# EasyEDA Pro project RinaBoard.eprj, board MasterControlPCB
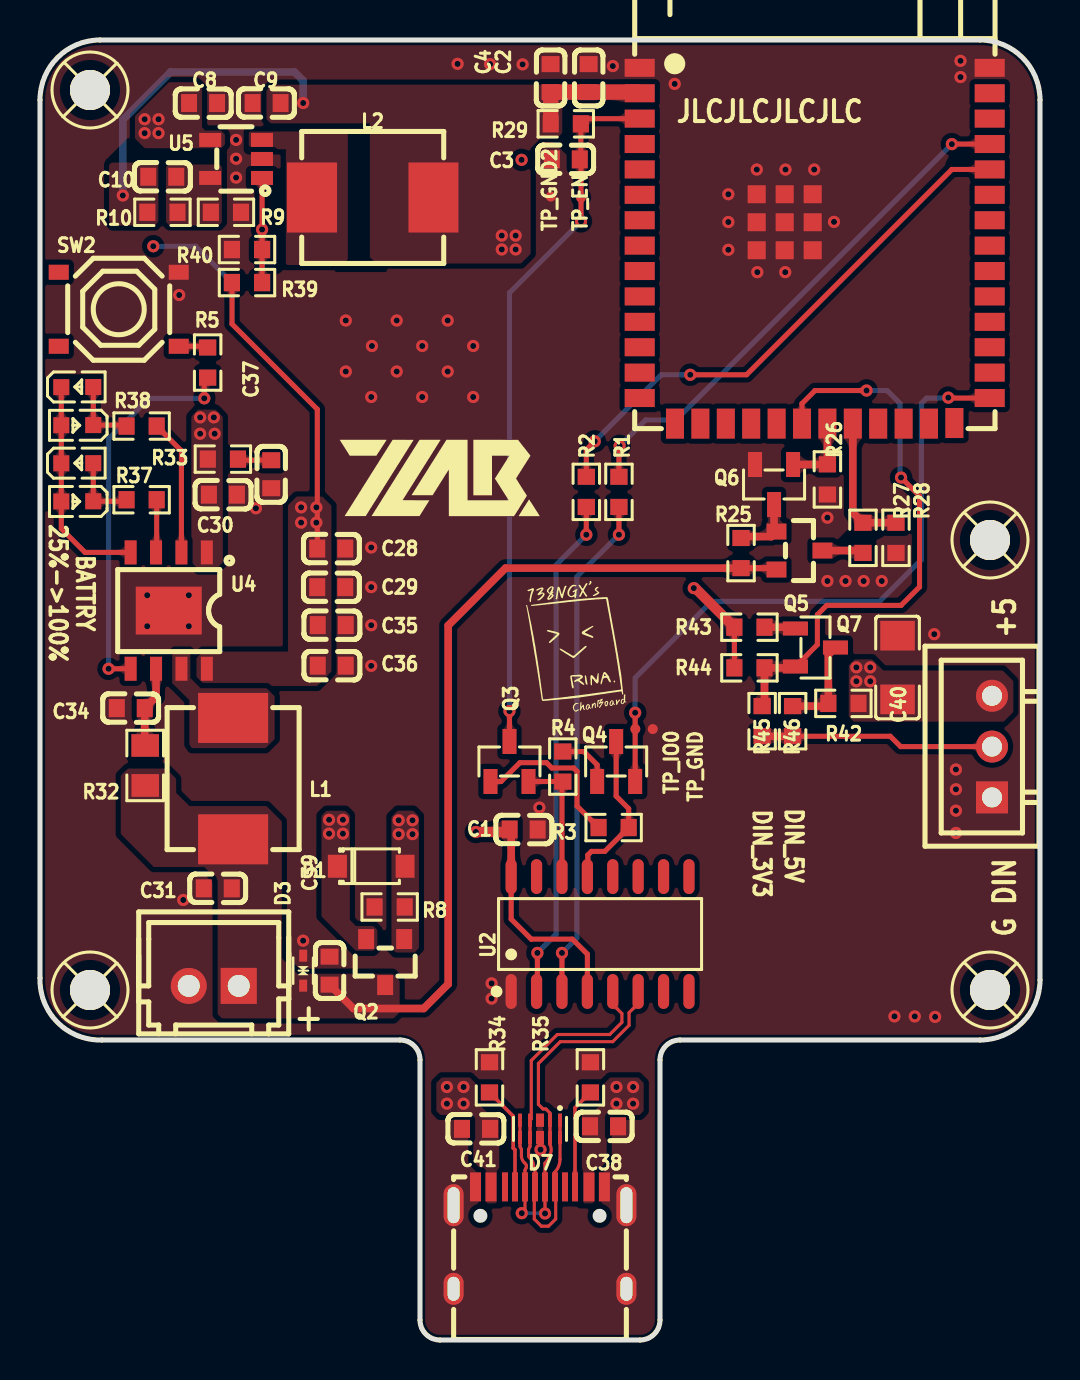
[diagram p7: board, top side]
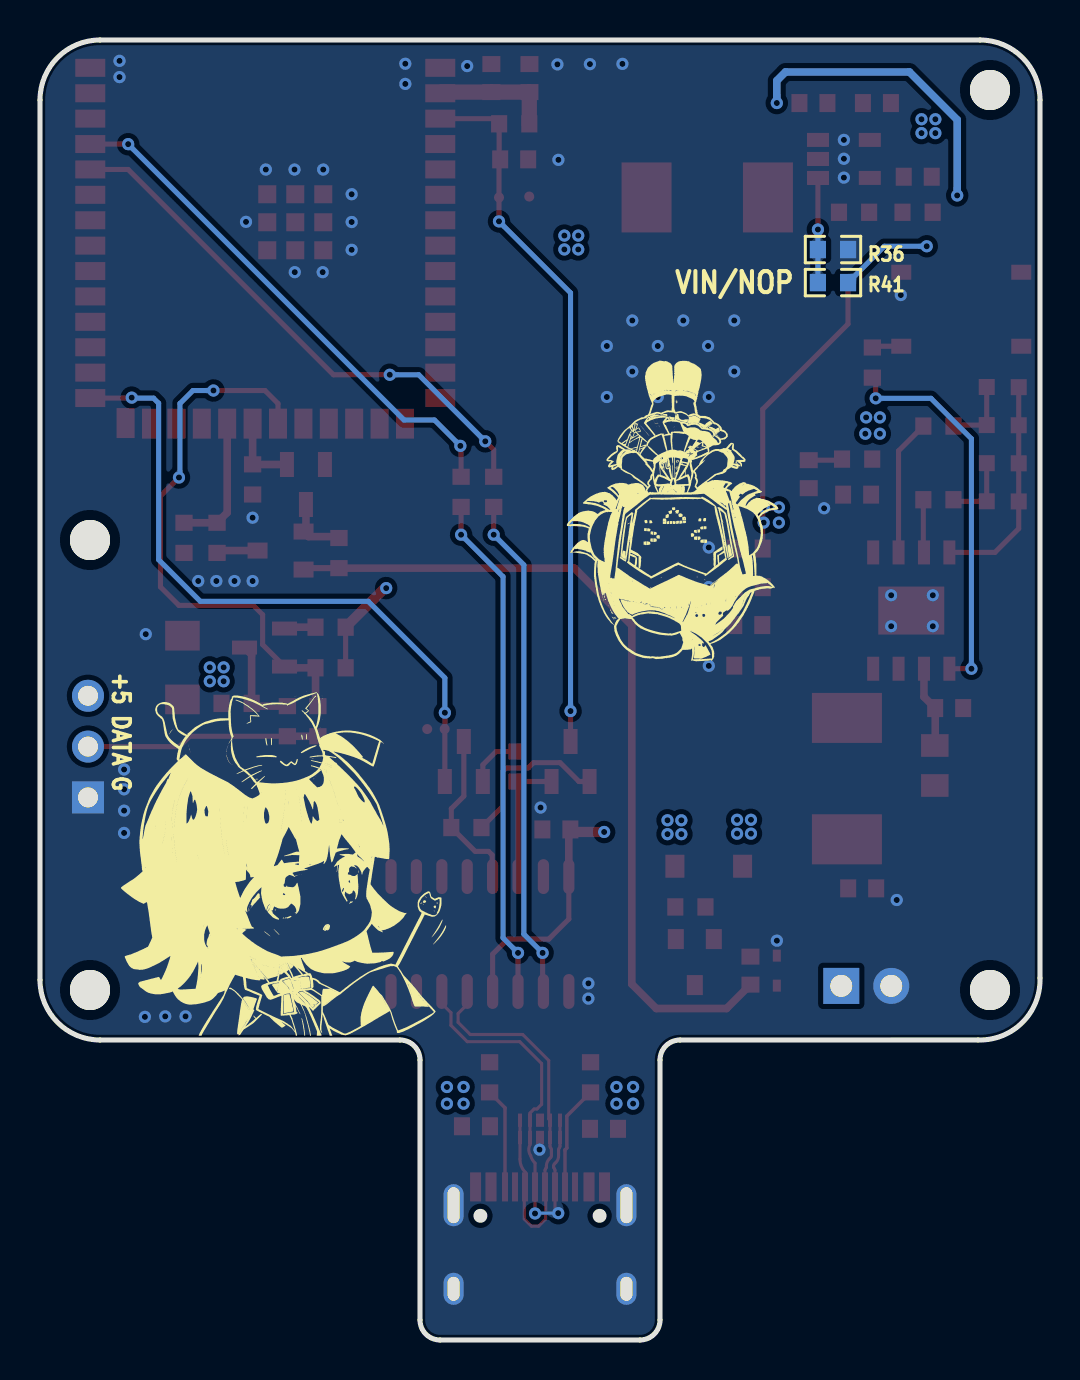
[diagram p8: board, bottom side, seen from below]

Outline 50 x 65 mm; copper layers: Top Layer, GND, PWR, Bottom Layer. Coordinates in mm from the lower left corner of the outline.
Outline path: 0,62 0,18.1 arc(0.88,15.88) 3.1,15 18,15 arc(18.71,14.71) 19,14 19,1 arc(19.29,0.29) 20,0 30,0 arc(30.71,0.29) 31,1 31,14 arc(31.29,14.71) 32,15 47,15 arc(49.12,15.88) 50,18 50,62 arc(49.12,64.12) 47,65 3,65 arc(0.88,64.12) 0,62
Stack: Top Layer 0.035mm 外层铜厚1oz / Dielectric1 0.2104mm 7628 RC49% 8.6mil / GND 0.0152mm 内层铜厚 / Dielectric2 1.065mm 1.1mm H/HOZ Copper / PWR 0.0152mm 内层铜厚 / Dielectric3 0.2104mm 7628 RC49% 8.6mil / Bottom Layer 0.035mm 外层铜厚1oz

## Design rules (mm)
net USB_P: USB
net USB_N: USB
template: 自定义配置
spacing copperThickness1oz (default): track to track 0.102, other pairs 0.152 to 0.3
spacing copperThickness2oz: track to track 0.203, other pairs 0.152 to 0.3
track width copperThickness1oz (default): min 0.127, default 0.254, max 2.54
track width copperThickness2oz: min 0.203, default 0.254, max 2.54
differential pair differentialPair (default): width min 0.127, default 0.155, max 2.54; gap min 0.152, default 0.203
via viaSize (default): diameter min 0.5, default 0.61, max 10; hole min 0.3, default 0.305, max 6.299

## Placement (name value [footprint] x y rotation side)
C1  0.1uF  [C0603]  24.18 25.53 180 top
C2  0.1uF  [C0603]  27.43 63.09 270 top
C3  1uF  [C0603]  26.29 59.03 0 top
C4  22uF  [C0603]  25.53 63.09 270 top
C8  10uF  [C0603]  8.15 61.85 180 top
C9  10uF/10V  [C0603]  11.33 61.85 0 top
C10  22pF  [C0603]  6.11 58.16 180 top
C28  22uF  [C0603]  14.56 39.57 180 top
C29  22uF  [C0603]  14.56 37.64 180 top
C30  10uF  [C0603]  9.14 42.27 180 top
C31  22uF/25V  [C0603]  8.89 22.58 0 top
C34  22uF  [C0603]  4.54 31.59 0 top
C35  22uF  [C0603]  14.59 35.74 180 top
C36  22uF  [C0603]  14.59 33.72 180 top
C37  10uF  [C0603]  11.56 43.29 90 top
C38  10uF  [C0603]  28.2 10.68 180 top
C39  10uF  [C0603]  14.48 18.47 270 top
C40  47uF  [C1206]  42.88 33.62 270 top
C41  10uF  [C0603]  21.8 10.56 0 top
CN1  BATTERY  [CONN-TH_2P-P2.50_HX25003-2A]  8.69 17.7 180 top
CN2  LED  [CONN-TH_3P-P2.54_2501S-3P]  47.6 29.67 90 top
D1  DSK34  [SOD-123_L2.8-W1.8-LS3.7-RD]  16.56 23.69 0 top
D3  ESD5B5.0ST1G-N  [SOD-523_L1.2-W0.8-LS1.6-BI]  13.16 18.47 90 top
D7  PUSB3F96X  [DFN2510-10_L2.5-W1.0-P0.50-BL]  25 10.56 180 top
L1  1uH  [IND-SMD_L7.1-W6.6_MJC-0603T]  9.66 28.07 270 top
L2  1uH  [IND-SMD_L7.1-W6.6_MJC-0603T]  16.64 57.13 0 top
LED1  FC-DA1608BK-470H10  [LED0603-RD_WHITE]  1.86 47.65 0 top
LED2  FC-DA1608BK-470H10  [LED0603-RD_WHITE]  1.86 45.74 180 top
LED3  FC-DA1608BK-470H10  [LED0603-RD_WHITE]  1.86 43.84 0 top
LED4  FC-DA1608BK-470H10  [LED0603-RD_WHITE]  1.86 41.93 180 top
Q2  AO3401A_C347476  [AO3401A_SOT-23-3]  17.26 18.9 90 top
Q3  S9013-E  [SOT-23-3_L2.9-W1.3-P1.90-LS2.4-BR]  23.47 28.92 270 top
Q4  S9013-E  [SOT-23-3_L2.9-W1.3-P1.90-LS2.4-BR]  28.81 28.92 270 top
Q5  AO3401A_C347476  [AO3401A_SOT-23-3]  37.97 39.47 180 top
Q6  AO3400A_C347475  [AO3400A_SOT-23-3]  36.7 42.78 90 top
Q7  AO3400A_C347475  [AO3400A_SOT-23-3]  38.77 34.62 180 top
R1  0R  [R0603]  28.95 42.41 270 top
R2  0R  [R0603]  27.32 42.41 90 top
R3  10k  [R0603]  28.68 25.62 180 top
R4  10k  [R0603]  26.14 28.67 90 top
R5  10K  [R0603]  8.38 48.87 270 top
R8  10K  [R0603]  17.48 21.65 0 top
R9  22K  [R0603]  9.3 56.39 180 top
R10  100K  [R0603]  6.12 56.39 180 top
R25  10K  [R0603]  35.05 39.35 270 top
R26  10K  [R0603]  39.37 43.03 90 top
R27  4.7K  [R0603]  41.15 40.11 270 top
R28  1K  [R0603]  42.8 40.11 90 top
R29  10k  [R0603]  26.29 60.81 0 top
R32  0.5R  [R0805]  5.26 28.73 270 top
R33  2R  [R0603]  9.14 44.05 0 top
R34  5.1k  [R0603]  22.47 13.13 270 top
R35  5.1k  [R0603]  27.52 13.13 270 top
R36  1M  [R0603]  10.35 54.52 180 bottom
R37  10k/nop  [R0603]  5.08 42.01 0 top
R38  10k/nop  [R0603]  5.08 45.7 0 top
R39  11k  [R0603]  10.35 52.87 0 top
R40  18k  [R0603]  10.35 54.52 180 top
R41  nop  [R0603]  10.35 52.87 0 bottom
R42  10k  [R0603]  40.17 31.83 180 top
R43  1k  [R0603]  35.47 35.64 0 top
R44  10k  [R0603]  35.47 33.61 0 top
R45  0R  [R0603]  36.11 30.94 270 top
R46  0R  [R0603]  37.63 30.94 270 top
SCREW1  -  [M2螺丝]  2.5 17.5 0 top
SCREW2  -  [M2螺丝]  2.5 62.5 0 top
SCREW3  -  [M2螺丝]  47.5 17.5 0 top
SCREW4  -  [M2螺丝]  47.5 40 0 top
SW2  TS-1187A-B-A-B  [SW-SMD_4P-L5.1-W5.1-P3.70-LS6.5-TL_H1.5]  3.94 51.54 180 top
TP_EN  -  [Test-Point-0.5mm]  27.05 57.13 180 top
TP_GND  -  [Test-Point-0.5mm]  30.64 30.55 270 top
TP_GND2  -  [Test-Point-0.5mm]  25.54 57.17 180 top
TP_IO0  -  [Test-Point-0.5mm]  29.77 30.55 270 top
U1  ESP32-S3-WROOM-1-N16R8  [WIRELM-SMD_ESP32-S3-WROOM-1]  38.74 54.71 0 top
U2  CH340C  [SOP-16_L10.0-W3.9-P1.27-LS6.0-BL]  28 20.3 0 top
U4  IP5307  [ESOP-8_L4.9-W3.9-P1.27-LS6.0-BL-EP]  6.44 36.47 180 top
U5  SY8089A1AAC  [TSOT-23-5_L2.9-W1.6-P0.95-LS2.8-BR]  9.81 59.05 0 top
USB1  TYPEC-304-BCP16  [USB-C-SMD_TYPEC-304-BCP16]  25 5.11 0 top

## Footprints (pads in the part's own frame, mm; a bottom-side part is the same pattern mirrored in y, then rotated)
AO3400A_SOT-23-3
  rect 1.25x0.7 smd: 1(1,-0.95) 2(1,0.95) 3(-1,0)
AO3401A_SOT-23-3
  rect 1x0.8 smd: 1(1.15,-0.95) 2(1.15,0.95) 3(-1.15,0)
C0603
  rect 0.8x0.9 smd: 1(-0.7,0) 2(0.7,0)
C1206
  rect 1.485x1.728 smd: 1(-1.593,0) 2(1.593,0)
CONN-TH_2P-P2.50_HX25003-2A
  rect 1.8x1.8 hole 1.1: 1(-1.25,0)
  round 1.8 hole 1.1: 2(1.25,0)
CONN-TH_3P-P2.54_2501S-3P
  rect 1.6x1.6 hole 1: 1(-2.54,0)
  round 1.6 hole 1: 2(0,0) 3(2.54,0)
DFN2510-10_L2.5-W1.0-P0.50-BL
  rect 0.2x0.665 smd: 1(-1,-0.433) 2(-0.5,-0.433) 4(0.5,-0.433) 5(1,-0.433) 6(1,0.433) 7(0.5,0.433) 9(-0.5,0.433) 10(-1,0.433)
  rect 0.4x0.665 smd: 3(0,-0.433) 8(0,0.433)
ESOP-8_L4.9-W3.9-P1.27-LS6.0-BL-EP
  rect 0.6x1.2 smd: 1(-1.905,-2.909) 2(-0.635,-2.909) 3(0.635,-2.909) 4(1.905,-2.909) 5(1.905,2.909) 6(0.635,2.909) 7(-0.635,2.909) 8(-1.905,2.909)
  rect 3.3x2.4 smd: 9(0,0)
IND-SMD_L7.1-W6.6_MJC-0603T
  rect 2.5x3.5 smd: 1(-3.035,0) 2(3.035,0)
LED0603-RD_WHITE
  rect 0.8x0.8 smd: 1(-0.799,-0.004) 2(0.799,0.004)
M2螺丝
  round 2 hole 2: 1(0,0)
R0603
  rect 0.806x0.864 smd: 1(-0.753,0) 2(0.753,0)
R0805
  rect 1.133x1.377 smd: 1(-1,0) 2(1,0)
SOD-123_L2.8-W1.8-LS3.7-RD
  rect 0.95x1.15 smd: 1(-1.692,0) 2(1.692,0)
SOD-523_L1.2-W0.8-LS1.6-BI
  rect 0.6x0.4 smd: 1(-0.75,0) 2(0.75,0)
SOP-16_L10.0-W3.9-P1.27-LS6.0-BL
  oval 0.56x1.745 smd: 1(-4.445,-2.873) 2(-3.175,-2.873) 3(-1.905,-2.873) 4(-0.635,-2.873) 5(0.635,-2.873) 6(1.905,-2.873) 7(3.175,-2.873) 8(4.445,-2.873) 9(4.445,2.873) 10(3.175,2.873) 11(1.905,2.873) 12(0.635,2.873) 13(-0.635,2.873) 14(-1.905,2.873) 15(-3.175,2.873) 16(-4.445,2.873)
SOT-23-3_L2.9-W1.3-P1.90-LS2.4-BR
  rect 1.25x0.7 smd: 1(1,-0.95) 2(1,0.95) 3(-1,0)
SW-SMD_4P-L5.1-W5.1-P3.70-LS6.5-TL_H1.5
  rect 1x0.75 smd: 1(-3,1.85) 2(3,1.85) 3(-3,-1.85) 4(3,-1.85)
Test-Point-0.5mm
  round 0.5 smd: 1(0,0)
TSOT-23-5_L2.9-W1.6-P0.95-LS2.8-BR
  rect 1.1x0.7 smd: 1(1.294,-0.951) 2(1.294,-0.001) 3(1.294,0.951) 4(-1.294,0.951) 5(-1.294,-0.949)
USB-C-SMD_TYPEC-304-BCP16
  oval 1x2.1 hole 0.6x1.8: 13(-4.32,1.633) 14(4.32,1.633)
  oval 1x1.6 hole 0.6x1.2: 15(-4.32,-2.547) 16(4.32,-2.547)
  rect 0.55x1.45 smd: A1B12(-3.225,2.547) A4B9(-2.45,2.547) B1A12(3.22,2.547) B4A9(2.45,2.547)
  rect 0.3x1.45 smd: A5(-1.25,2.547) A6(-0.25,2.547) A7(0.25,2.547) A8(1.25,2.547) B5(1.75,2.547) B6(0.75,2.547) B7(-0.75,2.547) B8(-1.75,2.547)
WIRELM-SMD_ESP32-S3-WROOM-1
  rect 1.5x0.9 smd: 1(-8.75,8.895) 2(-8.75,7.625) 3(-8.75,6.355) 4(-8.75,5.085) 5(-8.75,3.815) 6(-8.75,2.545) 7(-8.75,1.275) 8(-8.75,0.005) 9(-8.75,-1.265) 10(-8.75,-2.535) 11(-8.75,-3.805) 12(-8.75,-5.075) 13(-8.75,-6.345) 14(-8.75,-7.615) 27(8.75,-7.615) 28(8.75,-6.345) 29(8.75,-5.075) 30(8.75,-3.805) 31(8.75,-2.535) 32(8.75,-1.265) 33(8.75,0.005) 34(8.75,1.275) 35(8.75,2.545) 36(8.75,3.815) 37(8.75,5.085) 38(8.75,6.355) 39(8.75,7.625) 40(8.75,8.895)
  rect 0.9x1.5 smd: 15(-6.985,-8.895) 16(-5.715,-8.895) 17(-4.445,-8.895) 18(-3.175,-8.895) 19(-1.905,-8.895) 20(-0.635,-8.895) 21(0.635,-8.895) 22(1.905,-8.895) 23(3.175,-8.895) 24(4.445,-8.895) 25(5.715,-8.895) 26(6.985,-8.865)
  rect 0.9x0.9 smd: 41(-2.9,2.575) 41(-2.9,1.175) 41(-2.9,-0.225) 41(-1.5,2.575) 41(-1.5,1.175) 41(-1.5,-0.225) 41(-0.1,2.575) 41(-0.1,1.175) 41(-0.1,-0.225)

## Nets
+3V3: C1.2 C2.2 C4.2 C9.2 C10.2 L2.2 R10.2 R29.1 R43.1 R44.1 U1.2 U2.4 U2.16
+5V: C28.2 C29.2 C35.2 C36.2 C40.2 CN2.3 R39.1 R42.1 U4.8
GND: C1.1 C2.1 C3.1 C4.1 C8.1 C9.1 C28.1 C29.1 C30.1 C31.1 C34.1 C35.1 C36.1 C37.1 C38.1 C39.1 C40.1 C41.1 CN1.2 CN2.1 D3.2 D7.3 D7.8 Q6.2 R8.1 R9.1 R26.1 R28.1 R34.1 R35.1 R36.2 R40.2 SW2.3 TP_GND.1 TP_GND2.1 U1.1 U1.40 U1.41 U2.1 U4.9 U5.2 USB1.13 USB1.14 USB1.15 USB1.16 USB1.A1B12 USB1.B1A12
VBAT: C31.2 C39.2 CN1.1 D3.1 L1.2 Q2.3 Q5.2 R25.2 R32.2
VBUS: C30.2 C38.2 C41.2 D1.2 Q2.1 R8.2 R33.1 U4.1 USB1.A4B9 USB1.B4A9
VIN: C8.2 D1.1 Q2.2 R41.1 U5.4
ADC_BAT: R27.1 R28.2 U1.22
ADC_CON: Q6.1 R26.2 U1.21
CC1: R34.2 USB1.A5
CC2: R35.2 USB1.B5
CH_RXD: R1.2 U2.3
CH_TXD: R2.1 U2.2
DC_EN: R36.1 R39.2 R40.1 R41.2 U5.1
DTR: Q4.3 R3.1 U2.13
EN: C3.2 Q3.3 R29.2 TP_EN.1 U1.3
IO0: Q4.2 TP_IO0.1 U1.27
IP5307_KEY: R5.1 SW2.1
LED_DATA_3V3: Q7.2 R44.2 R45.1 U1.20
LED_DATA_5V: Q7.3 R42.2 R46.1
LED_DATA_OUT: CN2.2 R45.2 R46.2
MCU_RXD: R2.2 U1.36
MCU_TXD: R1.1 U1.37
RTS: Q3.2 R4.1 U2.14
USB_N: D7.2 D7.5 D7.6 D7.9 U2.6 USB1.A7 USB1.B7
USB_P: D7.1 D7.4 D7.7 D7.10 U2.5 USB1.A6 USB1.B6
$1N2176: Q3.1 R3.2
$1N2324: Q4.1 R4.2
$2N521: L1.1 U4.7
$2N524: R5.2 U4.5
$2N1221: C34.2 R32.1 U4.6
$2N1458: LED1.1 LED2.2 LED3.1 LED4.2 U4.4
$2N2157: C37.2 R33.2
$2N3725: L2.1 U5.3
$2N3729: C10.1 R9.2 R10.1 U5.5
$2N5657: R37.2 U4.3
$2N5662: LED3.2 LED4.1 R37.1
$2N5690: R38.2 U4.2
$2N5696: LED1.2 LED2.1 R38.1
$3N4901: Q7.1 R43.2
$4N342: Q5.3 R27.2
$4N345: Q5.1 Q6.3 R25.1

Pads without a net: SCREW1 1; SCREW2 1; SCREW3 1; SCREW4 1; SW2 2 4; U1 4 5 6 7 8 9 10 11 12 13 14 15 16 17 18 19 23 24 25 26 28 29 30 31 32 33 34 35 38 39; U2 7 8 9 10 11 12 15; USB1 A8 B8

## Via types
v1: diameter 0.61, hole 0.305, Top Layer to Bottom Layer, 122 vias

## Routing (per net, layer and track width the routed paths; a pad name or vN(x,y) marks a point on that pad's centre or on a via; arc(x,y) is an arc through that point)
+3V3: length 113.1
  Top Layer w0.254: U2.16 23.56,21.05 24.56,20.04 26.62,20.04 27.37,19.29 U2.4 ; R44.1 R43.1
  Top Layer w0.381: U2.16 23.56,25.45 C1.2
  Top Layer w0.508: R43.1 32.76,37.59 v1(32.69,37.59) ; C1.2 23.36,25.4 v1(21.79,25.4)
  Top Layer w0.762: R29.1 25.54,62.39 C4.2 C2.2 29.93,62.39 U1.2
  PWR w0.508: v1(21.79,25.4) 21.79,27.81 19.86,29.75 13.03,29.75 11.51,31.27 11.51,42.83 12.85,44.17 21.87,44.17 23.09,45.39 v1(23.09,54.53) v1(23.09,55.22) ; v1(32.69,37.59) 24.23,37.59 23.78,38.04 v1(23.78,54.53) v1(23.78,55.22)
  Bottom Layer w0.381: v1(13.16,61.85) 13.16,62.97 12.73,63.4 6.53,63.4 4.14,61.01 v1(4.14,57.23)
+5V: length 15.1
  Top Layer w0.254: C28.2 13.86,46.54 9.6,50.8 9.6,52.87 R39.1
  vias: v1(13.06,41.63) v1(13.06,40.87) v1(13.82,41.63) v1(13.82,40.87) v1(40.82,33.63) v1(40.82,32.94) v1(41.51,33.63) v1(41.51,32.94)
GND:
  vias: v1(5.36,37.24) v1(5.36,35.69) v1(6.96,52.25) v1(7.16,22) v1(7.44,37.24) v1(7.44,35.69) v1(9.81,60) v1(9.81,59.06) v1(9.81,58.12) v1(10.79,41.59) v1(13.16,19.97) v1(15.29,50.97) v1(15.29,48.42) v1(16.6,49.7) v1(16.56,47.15) v1(16.56,39.63) v1(16.56,37.64) v1(16.56,35.74) v1(16.56,33.71) v1(17.84,50.97) v1(17.84,48.42) v1(19.11,49.7) v1(19.11,47.15) v1(20.38,50.97) v1(20.38,48.42) v1(20.88,63.81) v1(21.66,49.7) v1(21.66,47.15) v1(22.5,63.79) v1(22.58,17.83) v1(22.58,17.07) v1(24.13,63.78) v1(24.08,59.01) v1(24.97,26.62) v1(25.03,9.52) v1(28.64,63.7) v1(31.74,63.81) v1(31.74,62.8) v1(34.42,57.29) v1(34.42,55.9) v1(34.42,54.51) v1(35.84,58.52) v1(35.87,53.39) v1(37.27,58.52) v1(37.26,53.39) v1(38.71,58.52) v1(39.37,41.11) v1(39.37,37.95) v1(39.7,55.91) v1(40.28,37.95) v1(41.18,37.95) v1(42.09,37.95) v1(42.72,16.18) v1(43.74,16.18) v1(44.71,35.29) v1(44.75,16.16) v1(45.8,28.53) v1(45.8,27.53) v1(45.8,26.47) v1(45.8,25.35) v1(46.03,63.96) v1(46.03,63.15)
VBAT: length 42.5
  Top Layer w0.305: Q5.2 36.75,38.59 R25.2
  Top Layer w0.381: R25.2 23.28,38.59 20.41,35.73 20.41,17.8 19.19,16.58 15.67,16.58 C39.2
VBUS:
  vias: v1(8.01,46.13) v1(8.01,45.31) v1(8.69,46.13) v1(8.73,45.31) v1(17.93,25.99) v1(17.93,25.29) v1(18.63,25.99) v1(18.63,25.29) v1(20.35,12.65) v1(20.35,11.82) v1(21.18,12.65) v1(21.18,11.82) v1(28.82,12.65) v1(28.82,11.82) v1(29.65,12.65) v1(29.65,11.82)
VIN: length 4.7
  Bottom Layer w0.254: v1(5.66,54.69) 7.78,54.69 R41.1
  vias: v1(5.23,61.04) v1(5.23,60.34) v1(5.93,61.04) v1(5.93,60.34) v1(14.45,26.01) v1(14.45,25.32) v1(15.15,26.01) v1(15.15,25.32)
ADC_BAT: length 6.8
  Top Layer w0.381: U1.22 40.64,41.37 R27.1 R28.2
ADC_CON: length 3.8
  Top Layer w0.381: U1.21 R26.2 39.36,43.78 Q6.1
CC1: length 5.3
  Top Layer w0.178: USB1.A5 23.75,9.51 23.66,9.6 23.66,11.19 22.47,12.38
CC2: length 5
  Top Layer w0.178: 27.52,12.38 26.75,11.61 26.75,7.66
CH_RXD: length 25.4
  Top Layer w0.254: 28.95,41.65 v1(28.95,40.26) ; U2.3 v1(26.1,19.35)
  Bottom Layer w0.254: v1(26.1,19.35) 26.85,20.1 26.85,38.17 v1(28.95,40.26)
CH_TXD: length 25.3
  Top Layer w0.254: v1(24.87,19.35) 24.87,17.47 U2.2 ; 27.32,41.65 v1(27.32,40.26)
  Bottom Layer w0.254: v1(24.87,19.35) 25.81,20.29 25.81,38.76 v1(27.32,40.26)
DC_EN: length 7.9
  Top Layer w0.254: U5.1 11.1,58.1 v1(11.1,55.53) R40.1 R39.2
  Bottom Layer w0.254: R39.2 R40.1 v1(11.1,55.53)
DTR: length 8.3
  Top Layer w0.254: U2.13 27.39,23.19 27.39,24.25 27.57,24.43 28.24,24.43 R3.1 29.43,26.57 28.81,27.19 Q4.3
EN: length 35.5
  Top Layer w0.254: v1(27.05,55.93) 27.05,57.13 27.05,58.97 C3.2 27.04,59.08 R29.2 27.3,61.07 U1.3 ; Q3.3 v1(23.47,31.45)
  Bottom Layer w0.254: v1(23.47,31.45) 23.47,52.36 v1(27.05,55.93)
IO0: length 33.3
  Top Layer w0.254: Q4.2 v1(29.76,31.36) ; v1(45.41,47.12) 45.44,47.1 U1.27
  Bottom Layer w0.254: v1(29.76,31.36) 29.76,33.1 33.59,36.93 41.99,36.93 44.07,39.02 44.07,46.84 44.32,47.09 45.39,47.09 v1(45.41,47.12)
IP5307_KEY: length 1.5
  Top Layer w0.254: SW2.1 8.32,49.69 R5.1
LED_DATA_3V3: length 28.3
  Top Layer w0.254: U1.20 38.1,46.82 38.75,47.47 v1(41.33,47.47) ; v1(43.05,43.12) 43.98,42.2 43.98,37.65 43.05,36.73 39.33,36.73 38.87,36.27 38.87,34.77 Q7.2
  Top Layer w0.381: Q7.2 37.71,33.61 R44.2 36.22,31.81 R45.1
  Bottom Layer w0.254: v1(41.33,47.47) 42.35,47.47 43,46.82 43,43.17 v1(43.05,43.12)
LED_DATA_5V: length 4.8
  Top Layer w0.381: R46.1 39.28,31.69 R42.2 39.42,34.27 Q7.3
LED_DATA_OUT: length 11.7
  Top Layer w0.254: CN2.2 43.03,29.67 42.51,30.19 R46.2
  Top Layer w0.381: R45.2 R46.2
MCU_RXD: length 27.3
  Top Layer w0.254: U1.36 45.59,58.53 35.33,48.26 v1(32.51,48.26) ; R2.2 27.32,44.51 v1(27.74,44.93)
  Bottom Layer w0.254: v1(27.74,44.93) 31.06,48.26 v1(32.51,48.26)
MCU_TXD: length 26.3
  Top Layer w0.254: v1(28.98,44.71) 28.95,44.67 R1.1 ; v1(45.59,59.79) 45.6,59.8 U1.37
  Bottom Layer w0.254: v1(28.98,44.71) 30.28,46 31.8,46 v1(45.59,59.79)
RTS: length 6.5
  Top Layer w0.254: U2.14 26.1,27.88 R4.1 26.13,27.92 Q3.2
USB_N: length 21.2
  Top Layer w0.155: U2.6 29.91,16.82 29.45,16.37 29.45,15.73 28.64,14.92 26.01,14.92 24.92,13.82 24.92,11.78 25.15,11.55 25.29,11.55 25.5,11.35 D7.2 D7.9 25.5,9.77 arc(25.56,9.49) 25.47,9.22 arc(25.38,9.02) 25.25,8.84 25.25,7.66 arc(25.25,7.66) 25.25,7.66 v1(25.25,6.33) ; v1(24.09,6.34) 24.25,6.5 24.25,8.48 arc(24.26,8.53) 24.29,8.57 arc(24.31,8.61) 24.32,8.66 24.32,8.71 arc(24.31,8.76) 24.28,8.8 24.21,8.87 arc(24.11,9.03) 24.07,9.21 24.07,9.52 arc(24.06,9.56) 24.04,9.6 arc(24.01,9.64) 24,9.69 D7.6 D7.5
  Top Layer w0.254: 25.25,7.66 arc(25.25,7.63) 25.27,7.61
  Bottom Layer w0.155: v1(24.09,6.34) 25.23,6.34 v1(25.25,6.33)
USB_P: length 21.5
  Top Layer w0.155: D7.1 D7.10 26,9.03 arc(25.93,8.68) 25.73,8.38 25.73,7.7 arc(25.74,7.68) 25.75,7.66 25.75,7.45 25.78,7.41 25.78,6.05 25.43,5.69 25.07,5.69 24.72,6.05 24.72,7.62 24.75,7.66 24.75,8.48 arc(24.74,8.53) 24.71,8.57 arc(24.69,8.61) 24.68,8.66 24.68,8.71 arc(24.64,8.89) 24.54,9.05 24.46,9.12 arc(24.44,9.16) 24.43,9.21 24.43,9.52 arc(24.44,9.56) 24.46,9.6 arc(24.49,9.64) 24.5,9.69 D7.7 D7.4 24.56,11.05 24.56,13.97 25.86,15.27 28.49,15.27 29.09,15.88 29.09,16.32 28.64,16.78 U2.5
$1N2176: length 8.2
  Top Layer w0.254: Q3.1 23.05,27.92 24,28.87 25.33,28.87 25.59,28.6 26.69,28.6 26.85,28.44 26.85,26.7 R3.2
$1N2324: length 2.8
  Top Layer w0.254: Q4.1 27.86,28.76 27.19,29.42 R4.2
$2N524: length 19.3
  Top Layer w0.254: R5.2 8.21,47.95 v1(8.21,47.08) ; U4.5 v1(3.43,33.56)
  Bottom Layer w0.254: v1(8.21,47.08) 5.45,47.08 3.43,45.06 v1(3.43,33.56)
$2N1221: length 4.1
  Top Layer w0.381: R32.1 5.24,29.75 C34.2 5.8,32.16 U4.6
$2N1458: length 11
  Top Layer w0.254: U4.4 2.25,39.38 1.06,40.57 1.06,47.64
$2N2157: length 1.7
  Top Layer w0.254: C37.2 9.95,43.99 R33.2
$2N5657: length 2.6
  Top Layer w0.254: U4.3 5.83,39.41 R37.2
$2N5662: length 3.6
  Top Layer w0.254: R37.1 4.25,41.94 LED4.1 LED3.2
$2N5690: length 6.8
  Top Layer w0.254: U4.2 7.07,44.46 R38.2
$2N5696: length 3.6
  Top Layer w0.254: LED1.2 2.66,45.75 4.28,45.75 R38.1
$3N4901: length 1.6
  Top Layer w0.381: R43.2 37.71,35.64 Q7.1
$4N342: length 2.1
  Top Layer w0.381: R27.2 41.03,39.47 Q5.3
$4N345: length 3.3
  Top Layer w0.381: R25.1 35.12,40.17 36.57,40.17 Q5.1 36.7,40.54 Q6.3

## Copper pours and planes (outline as drawn; the poured copper is in the pictures)
+3V3 on Top Layer: 11.61,62.77 26.11,62.77 26.11,60.35 25.91,60.15 25.09,60.15 24.54,59.59 24.54,54.31 24.05,53.82 16.81,53.82 16.49,54.14 16.49,60.83 11.53,60.83 11.32,61.04 11.32,62.48
+3V3 on Top Layer: 5.83,58.87 3.58,58.87 3.45,58.75 3.45,55.96 3.64,55.72 5.74,55.72 5.92,55.91 5.92,58.79
+3V3 on PWR: 23.08,55.61 22.86,55.42 22.86,45.6 22.83,45.57 23.01,45.39 24.04,45.39 24.04,55.39 23.81,55.61
+5V on Top Layer: 40.44,31.17 40.69,30.91 48.18,30.91 48.67,31.4 48.67,32.94 48.13,33.48 42.16,33.48 41.6,34.04 40.74,34.04 40.44,33.73
+5V on Top Layer: 7.82,33 7.82,34.1 8.14,34.42 12.4,34.42 12.4,41.74 12.84,42.18 14.11,42.18 14.57,41.72 14.57,33.42 13.85,32.7 8.12,32.7
+5V on PWR: 13.68,43.26 12.4,41.81 12.4,31.61 13.51,30.49 20.85,30.49 21.95,29.4 21.95,15.52 21.92,15.5 23.16,14.25 28.85,14.25 31.14,16.54 44.63,16.54 46.51,18.42 46.51,35.58 49.07,35.58 49.07,63.02 47.75,64.34 26.24,64.34 24.32,62.41 24.32,39.74 25.27,38.79 32.33,38.79 33.71,37.42 32.94,36.65 23.77,36.65 22.81,37.62 22.81,42.52 22.07,43.26
GND on Top Layer: -3.2,67.82 54.64,67.82 54.64,-4.19 -3.2,-4.19
GND on Bottom Layer: -3.2,67.82 54.64,67.82 54.64,-4.19 -3.2,-4.19
GND on GND: -3.2,67.82 54.64,67.82 54.64,-4.19 -3.2,-4.19
VBAT on Top Layer: 17.64,18.31 12.86,18.31 12.09,19.08 12.09,25.94 11.33,26.7 7.47,26.7 6.81,27.36 6.81,28.07 6.3,28.57 4.39,28.57 4.04,28.22 4.04,25.3 5.69,23.65 8.22,23.65 8.88,22.98 8.88,16.29 9.09,16.08 17.68,16.08 17.98,16.38 17.98,17.96
VBUS on Top Layer: 17.88,26.47 18.67,26.47 18.95,26.19 18.95,19.6 18.73,19.38 17.79,19.38 17.57,19.6 17.57,26.16
VBUS on Top Layer: 28.33,8.92 28,8.59 27.83,8.59 27.83,6.83 27.04,6.83 27.04,11.2 27.12,11.31 27.57,11.31 28.19,11.92 28.19,12.8 28.51,13.13 29.91,13.13 30.19,12.85 30.19,11.46 29.99,11.25 28.5,11.25 28.33,11.19
VBUS on Top Layer: 7.57,46.17 7.89,46.51 8.79,46.51 9.14,46.16 9.14,38.88 8.78,38.52 7.94,38.52 7.57,38.89
VBUS on Top Layer: 21.67,8.92 22,8.59 22.17,8.59 22.17,6.83 22.96,6.83 22.96,11.2 22.88,11.31 22.43,11.31 21.81,11.92 21.81,12.8 21.49,13.13 20.09,13.13 19.81,12.85 19.81,11.46 20.01,11.25 21.5,11.25 21.67,11.19
VBUS on PWR: 30.45,1.02 29.77,0.33 20.35,0.33 19.71,0.97 19.71,14.12 16.89,16.94 16.89,25.95 15.61,27.23 8.62,27.23 7.09,28.75 7.09,63.42 7.87,64.29 7.87,64.39 23.16,64.39 23.82,63.73 23.82,56.92 22.5,55.6 22.5,46.38 21.05,44.93 12.21,44.93 10.62,43.34 10.62,31.09 12.65,29.06 19.51,29.06 21.13,27.43 21.13,15.32 22.86,13.59 29.62,13.59 30.4,12.8 30.4,1.07
VIN on Top Layer: 9.04,60.48 8.25,60.48 8.1,60.63 8.1,62.59 7.8,62.89 6.45,62.89 4.75,61.19 4.75,60.07 5.23,59.59 9.07,59.59 9.25,59.77 9.25,60.28
VIN on Top Layer: 16.66,19.46 15.8,19.46 14.07,21.19 14.07,26.21 14.32,26.46 15.27,26.46 15.49,26.24 15.49,21.01 15.8,20.7 16.66,20.7 16.87,20.5 16.87,19.66
VIN on PWR: 7.91,26.52 6.36,28.07 6.36,63.48 5.33,64.5 1.93,64.5 0.6,63.17 0.6,17.73 2.56,15.67 14.76,15.67 15.9,16.82 15.9,25.88 15.27,26.52
$2N521 on Top Layer: 6.61,34.27 6.76,34.42 7.47,34.42 7.52,34.34 7.52,33.1 8.03,32.59 11.33,32.59 11.74,32.18 11.74,30.05 11.28,29.59 7.6,29.59 7.47,29.78 7.47,31.99 6.77,32.69 6.76,32.69 6.61,32.84
$2N3725 on Top Layer: 10.44,60.38 10.44,59.54 12.29,59.54 12.29,53.75 15.11,53.75 15.39,54.03 15.39,60.43 10.49,60.43
$2N3729 on Top Layer: 6.43,58.78 6.3,58.65 6.3,55.91 6.48,55.73 8.94,55.73 9.09,55.88 9.09,58.65 8.97,58.78

Small or netless copper shapes (teardrops, artwork), in the pictures only: 153 on Top Layer, 26 on Bottom Layer, 8 on PWR

## Text on the board
Bottom Silkscreen Layer: +5 DATA G | VIN/NOP
Top Silkscreen Layer: BATTRY / 25%->100% | DIN_3V3 | DIN_5V | JLCJLCJLCJLC | +5 | G DIN | +
